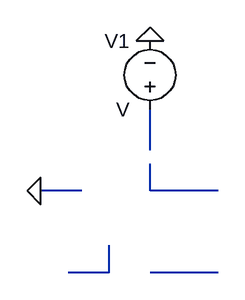
[diagram p0: schematic Draft2.asc]
Draft2.asc, the LTspice schematic file:
Version 4
SHEET 1 880 680
WIRE 256 32 256 -16
WIRE 176 80 128 80
WIRE 256 80 256 48
WIRE 336 80 256 80
WIRE 208 176 208 144
WIRE 208 176 160 176
WIRE 336 176 256 176
FLAG 128 80 0
FLAG 256 -96 0
SYMBOL voltage 256 0 R180
WINDOW 0 24 96 Left 2
WINDOW 3 24 16 Left 2
SYMATTR InstName V1

The netlist it stands for:
* Draft2.asc
V1 N001 0 V
.backanno
.end